# Altium schematic sheet POWER.SchDoc: Power Supply
size 420 x 297 mm; SheetNumber: 2; SheetTotal: 10
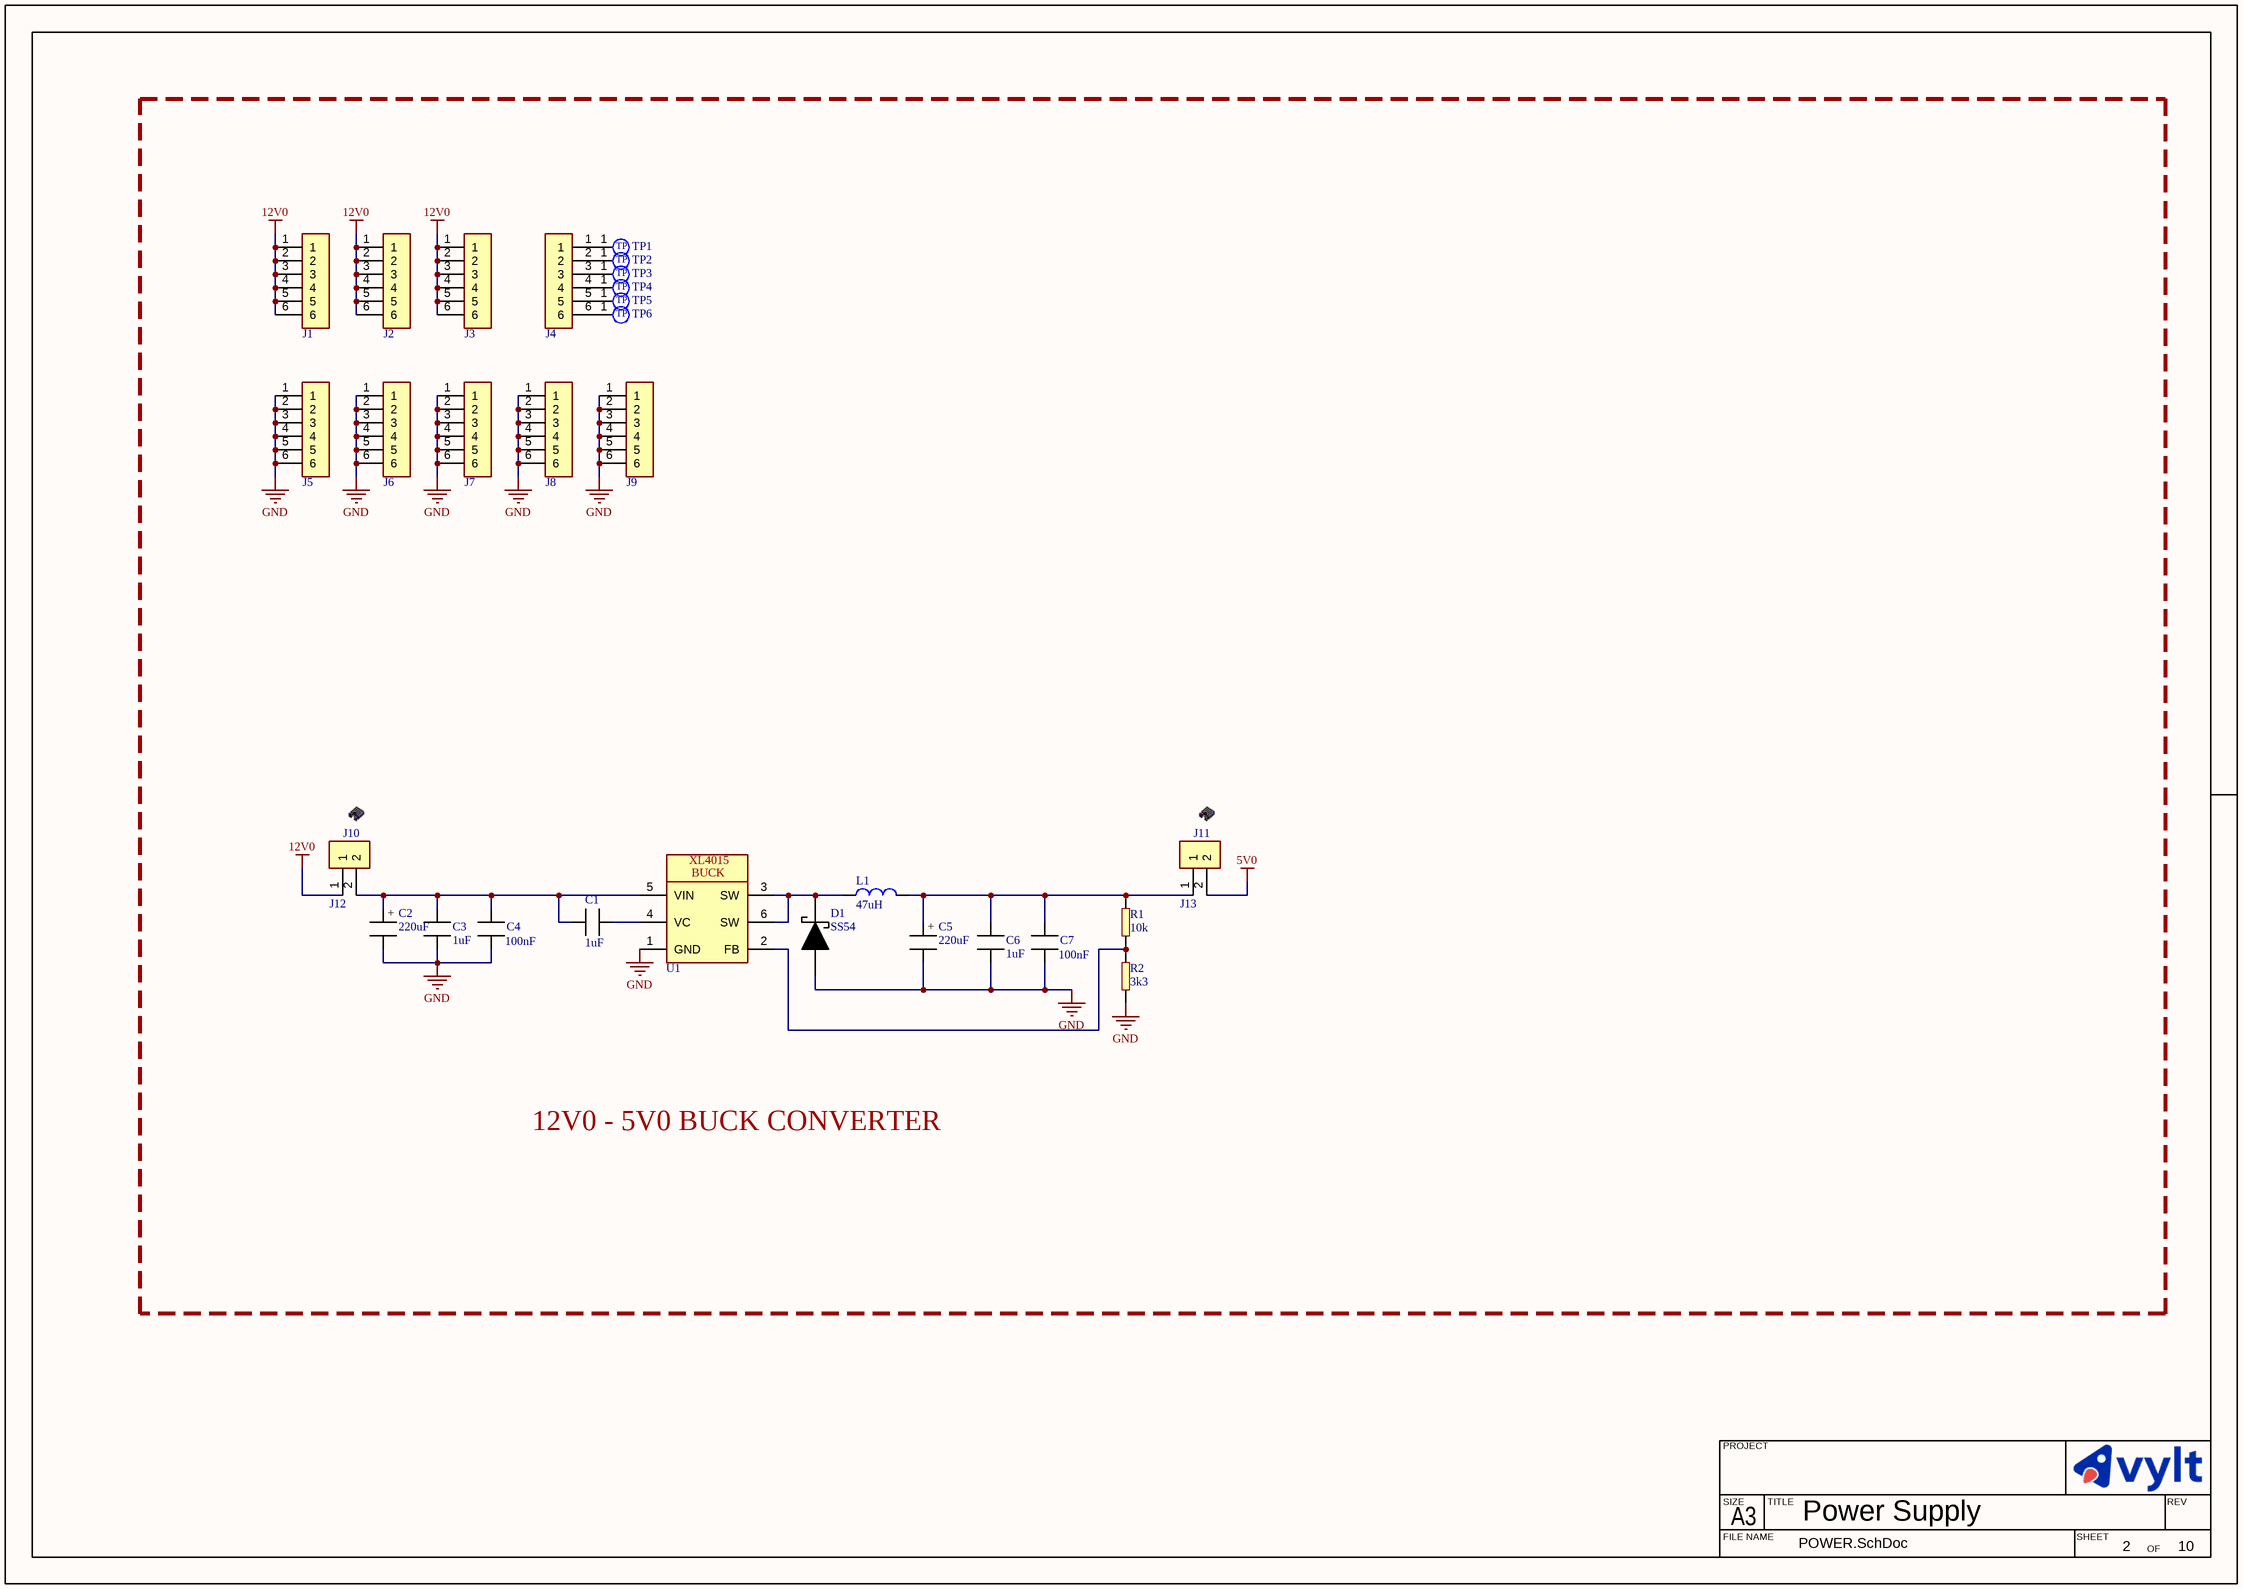
[diagram p0: POWER.SchDoc]

## Parts
C1  value 1uF  [CAPC2012X13L]  (hidden comment: MLCC_0805)
C2  value 220uF  [CAP_D10_H16_P5 - Flat]  (hidden comment: ERP_102-2)
C3  value 1uF  [CAPC2012X13L]  (hidden comment: MLCC_0805)
C4  value 100nF  [CAPC2012X13L]  (hidden comment: MLCC_0805)
C5  value 220uF  [CAP_D10_H16_P5 - Flat]  (hidden comment: ERP_102-2)
C6  value 1uF  [CAPC2012X13L]  (hidden comment: MLCC_0805)
C7  value 100nF  [CAPC2012X13L]  (hidden comment: MLCC_0805)
D1  value SS54  [DIOM6959X26L]  (hidden comment: ERP_104-3)
J1  6PX1R_M  [6PX1R_M_STK20]  (value not drawn)
J2  6PX1R_M  [6PX1R_M_STK20]  (value not drawn)
J3  6PX1R_M  [6PX1R_M_STK20]  (value not drawn)
J4  6PX1R_M  [6PX1R_M_STK20]  (value not drawn)
J5  6PX1R_M  [6PX1R_M_STK20]  (value not drawn)
J6  6PX1R_M  [6PX1R_M_STK20]  (value not drawn)
J7  6PX1R_M  [6PX1R_M_STK20]  (value not drawn)
J8  6PX1R_M  [6PX1R_M_STK20]  (value not drawn)
J9  6PX1R_M  [6PX1R_M_STK20]  (value not drawn)
J10  Jumper Cap  (value not drawn)  (mechanical)
J11  Jumper Cap  (value not drawn)  (mechanical)
J12  2PX1R  [2PX1R]  (value not drawn)
J13  2PX1R  [2PX1R]  (value not drawn)
L1  value 47uH  [IND_1212]  (hidden comment: ERP_103-3)
R1  value 10k  [RES_0603]  (hidden comment: ERP_101-1)
R2  value 3k3  [RES_0603]  (hidden comment: ERP_101-1)
TP1  TP_1MM  [TP_1MM]  (value not drawn)  (no BOM)
TP2  TP_1MM  [TP_1MM]  (value not drawn)  (no BOM)
TP3  TP_1MM  [TP_1MM]  (value not drawn)  (no BOM)
TP4  TP_1MM  [TP_1MM]  (value not drawn)  (no BOM)
TP5  TP_1MM  [TP_1MM]  (value not drawn)  (no BOM)
TP6  TP_1MM  [TP_1MM]  (value not drawn)  (no BOM)
U1  XL4015  [XL4015]  (value not drawn)

## Blocks framed on the sheet
12V0 - 5V0 BUCK CONVERTER: C1-C7 D1 J1-J13 L1 R1 R2 TP1-TP6 U1

## Nets
5V0: J13.2
12V0: J1.1 J1.2 J1.3 J1.4 J1.5 J1.6 J2.1 J2.2 J2.3 J2.4 J2.5 J2.6 J3.1 J3.2 J3.3 J3.4 J3.5 J3.6 J12.1
GND: C2.2 C3.1 C4.2 C5.2 C6.1 C7.2 D1.2(A) J5.1 J5.2 J5.3 J5.4 J5.5 J5.6 J6.1 J6.2 J6.3 J6.4 J6.5 J6.6 J7.1 J7.2 J7.3 J7.4 J7.5 J7.6 J8.1 J8.2 J8.3 J8.4 J8.5 J8.6 J9.1 J9.2 J9.3 J9.4 J9.5 J9.6 R2.2 U1.1(GND)
NetC1_1: C1.1 C2.1 C3.2 C4.1 J12.2 U1.5(VIN)
NetC1_2: C1.2 U1.4(VC)
NetC5_1: C5.1 C6.2 C7.1 J13.1 L1.2 R1.1
NetD1_1: D1.1(C) L1.1 U1.3(SW) U1.6(SW)
NetJ4_1: J4.1 TP1.1
NetJ4_2: J4.2 TP2.1
NetJ4_3: J4.3 TP3.1
NetJ4_4: J4.4 TP4.1
NetJ4_5: J4.5 TP5.1
NetJ4_6: J4.6 TP6.1
NetR1_2: R1.2 R2.1 U1.2(FB)

## Notes on the sheet
- PROJECT
- SIZE
- FILE NAME
- A3
- TITLE
- SHEET
- OF
- REV
- (in symbol CAP_D10_H16_P5) +
- (in symbol TP_1MM) TP
- (in symbol XL4015) BUCK

## Library data of the parts
C1 C3 C4 C6 C7 = MLCC_0805: Chip Capacitor, 2-Leads, Body 2.00x1.25mm, IPC High Density; Package: 0805; Manufacturer 1: *; Manufacturer Part Number 1: *
C2 C5 = CAP_D10_H16_P5: Electrolytic Capacitor Through Hole D10 P5.0; Package: 10X5; Manufacturer 1: *; Manufacturer Part Number 1: *; Supplier 1: *
D1 = SS54: Supplier Part Number 1: *; Supplier  1: *; Package: SMC; Manufacturer Part Number 1: *; Manufacturer 1: *; ERP: *
J1-J9 = 6PX1R_M: 6PX1R Male Header; Value: *; Manufacturer 1: *; Manufacturer Part Number 1: *
J10 J11 = Jumper Cap: 2 Pin Jumper Cap P2.54; Manufacturer Part Number 1: *; Manufacturer 1: *; Value: *
L1 = IND_1212: Manufacturer 1: Würth Elektronik; Manufacturer Part Number 1: *
R1 R2 = RES_0603: Package: 0603; Manufacturer 1: *; Manufacturer Part Number 1: *
U1 = XL4015: 5A 180KHz 36V Buck DC to DC Converter; Manufacturer 1: XLSemi; Manufacturer Part Number 1: XL4015E1; Value: *